# EAGLE schematic Proto_ARM (EAGLE 6.3)
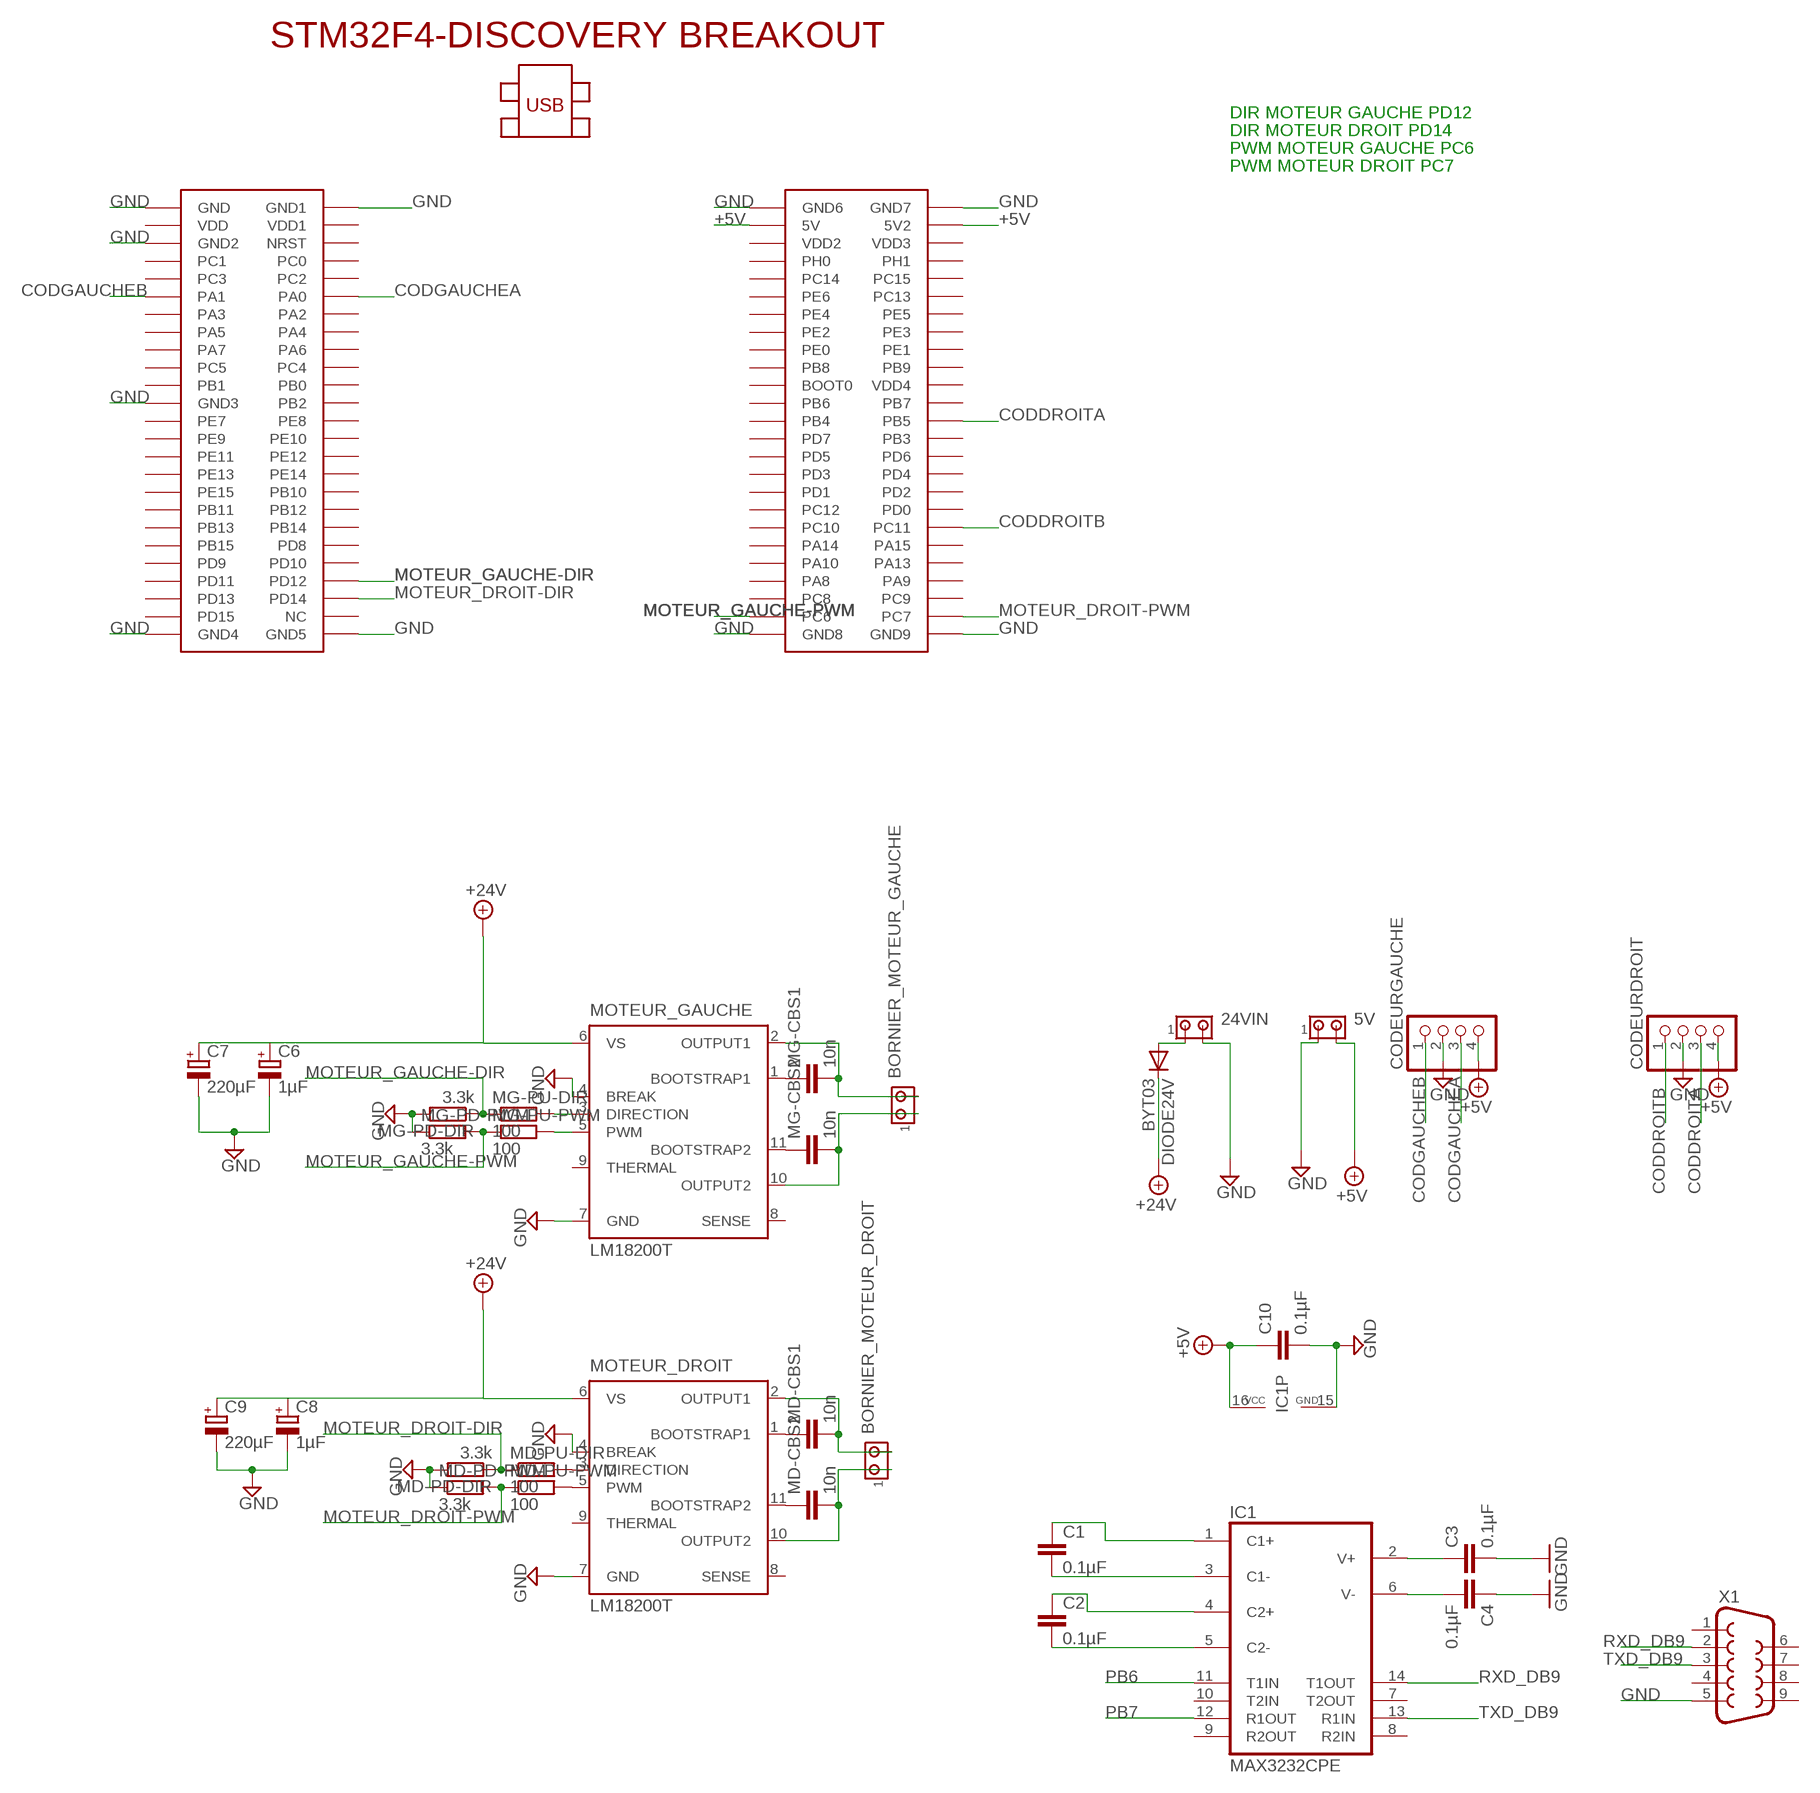
[diagram p0: schematic, sheet 1]

## Parts
5V  MTA02-156  [1X2MTA]
24VIN  MTA02-156  [1X2MTA]
BORNIER_MOTEUR_DROIT  MTA02-156  [1X2MTA]
BORNIER_MOTEUR_GAUCHE  MTA02-156  [1X2MTA]
C1  0.1µF  C-EU050-035X075  [C050-035X075]
C2  0.1µF  C-EU050-035X075  [C050-035X075]
C3  0.1µF  C-EU050-035X075  [C050-035X075]
C4  0.1µF  C-EU050-035X075  [C050-035X075]
C6  1µF  CPOL-EUE3.5-8  [E3,5-8]
C7  220µF  CPOL-EUE3.5-8  [E3,5-8]
C8  1µF  CPOL-EUE3.5-8  [E3,5-8]
C9  220µF  CPOL-EUE3.5-8  [E3,5-8]
C10  0.1µF  C-EU050-035X075  [C050-035X075]
CODEURDROIT  PINHD-1X4  [1X04]
CODEURGAUCHE  PINHD-1X4  [1X04]
DIODE24V  BYT03  [DO27-15]
IC1  MAX3232CPE  [DIL16]
MD-CBS1  10n  C-EU050-025X075  [C050-025X075]
MD-CBS2  10n  C-EU050-025X075  [C050-025X075]
MD-PD-DIR  3.3k  R-EU_0207/7  [0207/7]
MD-PD-PWM  3.3k  R-EU_0207/7  [0207/7]
MD-PU-DIR  100  R-EU_0207/7  [0207/7]
MD-PU-PWM  100  R-EU_0207/7  [0207/7]
MG-CBS1  10n  C-EU050-025X075  [C050-025X075]
MG-CBS2  10n  C-EU050-025X075  [C050-025X075]
MG-PD-DIR  3.3k  R-EU_0207/7  [0207/7]
MG-PD-PWM  3.3k  R-EU_0207/7  [0207/7]
MG-PU-DIR  100  R-EU_0207/7  [0207/7]
MG-PU-PWM  100  R-EU_0207/7  [0207/7]
MOTEUR_DROIT  LM18200T  [TO-220-11]
MOTEUR_GAUCHE  LM18200T  [TO-220-11]
U$1  STM32F4-DISCOVERY  [STM32F4-DISCOVERY]
X1  F09HP  [F09HP]

## Nets
+5V: 5V.2 C10.1 CODEURDROIT.4 CODEURGAUCHE.4 IC1.16(VCC) U$1.P$53(5V) U$1.P$54(5V2)
+24V: C6.+ C7.+ C8.+ C9.+ DIODE24V.C MOTEUR_DROIT.6(VS) MOTEUR_GAUCHE.6(VS)
CODDROITA: CODEURDROIT.3 U$1.P$76(PB5)
CODDROITB: CODEURDROIT.1 U$1.P$88(PC11)
CODGAUCHEA: CODEURGAUCHE.3 U$1.P$12(PA0)
CODGAUCHEB: CODEURGAUCHE.1 U$1.P$11(PA1)
GND: 5V.1 24VIN.2 C3.2 C4.1 C6.- C7.- C8.- C9.- C10.2 CODEURDROIT.2 CODEURGAUCHE.2 IC1.15(GND) MD-PD-DIR.2 MD-PD-PWM.1 MG-PD-DIR.2 MG-PD-PWM.1 MOTEUR_DROIT.4(BREAK) MOTEUR_DROIT.7(GND) MOTEUR_GAUCHE.4(BREAK) MOTEUR_GAUCHE.7(GND) U$1.P$1(GND) U$1.P$2(GND1) U$1.P$5(GND2) U$1.P$23(GND3) U$1.P$49(GND4) U$1.P$50(GND5) U$1.P$51(GND6) U$1.P$52(GND7) U$1.P$99(GND8) U$1.P$100(GND9) X1.5
MOTEUR_DROIT-DIR: MD-PD-DIR.1 MD-PU-DIR.1 U$1.P$46(PD14)
MOTEUR_DROIT-PWM: MD-PD-PWM.2 MD-PU-PWM.1 U$1.P$98(PC7)
MOTEUR_GAUCHE-DIR: MG-PD-DIR.1 MG-PU-DIR.1 U$1.P$44(PD12)
MOTEUR_GAUCHE-PWM: MG-PD-PWM.2 MG-PU-PWM.1 U$1.P$97(PC6)
N$4: C1.1 IC1.1(C1+)
N$5: MG-CBS1.1 MOTEUR_GAUCHE.1(BOOTSTRAP1)
N$6: MG-CBS2.1 MOTEUR_GAUCHE.11(BOOTSTRAP2)
N$7: MD-CBS2.1 MOTEUR_DROIT.11(BOOTSTRAP2)
N$8: MD-CBS1.1 MOTEUR_DROIT.1(BOOTSTRAP1)
N$9: BORNIER_MOTEUR_DROIT.2 MD-CBS1.2 MOTEUR_DROIT.2(OUTPUT1)
N$10: BORNIER_MOTEUR_DROIT.1 MD-CBS2.2 MOTEUR_DROIT.10(OUTPUT2)
N$11: BORNIER_MOTEUR_GAUCHE.1 MG-CBS2.2 MOTEUR_GAUCHE.10(OUTPUT2)
N$12: BORNIER_MOTEUR_GAUCHE.2 MG-CBS1.2 MOTEUR_GAUCHE.2(OUTPUT1)
N$13: C4.2 IC1.6(V-)
N$14: MG-PU-DIR.2 MOTEUR_GAUCHE.3(DIRECTION)
N$15: MG-PU-PWM.2 MOTEUR_GAUCHE.5(PWM)
N$16: MD-PU-DIR.2 MOTEUR_DROIT.3(DIRECTION)
N$17: MD-PU-PWM.2 MOTEUR_DROIT.5(PWM)
N$18: C3.1 IC1.2(V+)
N$24: C1.2 IC1.3(C1-)
N$25: 24VIN.1 DIODE24V.A
N$27: C2.1 IC1.4(C2+)
N$30: C2.2 IC1.5(C2-)
PB6: IC1.11(T1IN)
PB7: IC1.12(R1OUT)
RXD_DB9: IC1.14(T1OUT) X1.2
TXD_DB9: IC1.13(R1IN) X1.3
Unconnected: IC1.7(T2OUT) IC1.8(R2IN) IC1.9(R2OUT) IC1.10(T2IN) MOTEUR_DROIT.8(SENSE) MOTEUR_DROIT.9(THERMAL) MOTEUR_GAUCHE.8(SENSE) MOTEUR_GAUCHE.9(THERMAL) U$1.P$3(VDD) U$1.P$4(VDD1) U$1.P$6(NRST) U$1.P$7(PC1) U$1.P$8(PC0) U$1.P$9(PC3) U$1.P$10(PC2) U$1.P$13(PA3) U$1.P$14(PA2) U$1.P$15(PA5) U$1.P$16(PA4) U$1.P$17(PA7) U$1.P$18(PA6) U$1.P$19(PC5) U$1.P$20(PC4) U$1.P$21(PB1) U$1.P$22(PB0) U$1.P$24(PB2) U$1.P$25(PE7) U$1.P$26(PE8) U$1.P$27(PE9) U$1.P$28(PE10) U$1.P$29(PE11) U$1.P$30(PE12) U$1.P$31(PE13) U$1.P$32(PE14) U$1.P$33(PE15) U$1.P$34(PB10) U$1.P$35(PB11) U$1.P$36(PB12) U$1.P$37(PB13) U$1.P$38(PB14) U$1.P$39(PB15) U$1.P$40(PD8) U$1.P$41(PD9) U$1.P$42(PD10) U$1.P$43(PD11) U$1.P$45(PD13) U$1.P$47(PD15) U$1.P$48(NC) U$1.P$55(VDD2) U$1.P$56(VDD3) U$1.P$57(PH0) U$1.P$58(PH1) U$1.P$59(PC14) U$1.P$60(PC15) U$1.P$61(PE6) U$1.P$62(PC13) U$1.P$63(PE4) U$1.P$64(PE5) U$1.P$65(PE2) U$1.P$66(PE3) U$1.P$67(PE0) U$1.P$68(PE1) U$1.P$69(PB8) U$1.P$70(PB9) U$1.P$71(BOOT0) U$1.P$72(VDD4) U$1.P$73(PB6) U$1.P$74(PB7) U$1.P$75(PB4) U$1.P$77(PD7) U$1.P$78(PB3) U$1.P$79(PD5) U$1.P$80(PD6) U$1.P$81(PD3) U$1.P$82(PD4) U$1.P$83(PD1) U$1.P$84(PD2) U$1.P$85(PC12) U$1.P$86(PD0) U$1.P$87(PC10) U$1.P$89(PA14) U$1.P$90(PA15) U$1.P$91(PA10) U$1.P$92(PA13) U$1.P$93(PA8) U$1.P$94(PA9) U$1.P$95(PC8) U$1.P$96(PC9) X1.1 X1.4 X1.6 X1.7 X1.8 X1.9

## Notes on the sheet
- DIR MOTEUR GAUCHE PD12
- DIR MOTEUR DROIT PD14
- PWM MOTEUR GAUCHE PC6
- PWM MOTEUR DROIT PC7

## Library data of the parts
5V 24VIN BORNIER_MOTEUR_DROIT BORNIER_MOTEUR_GAUCHE = con-amp:MTA02-156: AMP connector
C1-C4 C10 MD-CBS1 MD-CBS2 MG-CBS1 MG-CBS2 = rcl:C-EU: CAPACITOR, European symbol
C6-C9 = rcl:CPOL-EU: POLARIZED CAPACITOR, European symbol
CODEURDROIT CODEURGAUCHE = pinhead:PINHD-1X4: PIN HEADER
DIODE24V = diode:BYT03: DIODE ultra fast
IC1 = maxim:MAX3232*: True RS-232 Transceivers 3.0V to 5.5V, Low-Power up to 1Mbps, Using Four 0.1µF External Capacitors Source: http://pdfserv.maxim-ic.com/en/ds/MAX3222-MAX3241.pdf; MF: MAXIM; MPN: MAX3232CPE+; OC_FARNELL: 9724494; OC_NEWARK: 68K4626
MD-PD-DIR MD-PD-PWM MD-PU-DIR MD-PU-PWM MG-PD-DIR MG-PD-PWM MG-PU-DIR MG-PU-PWM = rcl:R-EU_: RESISTOR, European symbol
MOTEUR_DROIT MOTEUR_GAUCHE = national-semiconductor:LM18200T: 3A, 55V H-Bridge Motor Control SourcE: http://cache.national.com/ds/LM/LMD18200.pdf; OC_FARNELL: unknown; OC_NEWARK: unknown
U$1 = STM32F4-DISCOVERY:STM32F4-DISCOVERY
X1 = con-subd:F09: SUB-D; OC_FARNELL: unknown; OC_NEWARK: unknown